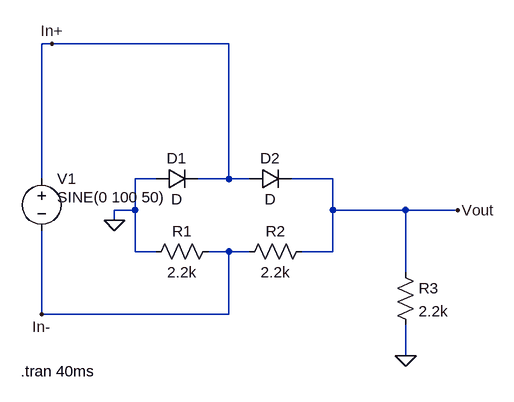
[diagram p0: schematic Assignment 3-2.asc]
Assignment 3-2.asc, the LTspice schematic file:
Version 4.1
SHEET 1 880 680
WIRE 48 -64 32 -64
WIRE 320 -64 48 -64
WIRE 32 144 32 -64
WIRE 208 144 176 144
WIRE 320 144 320 -64
WIRE 320 144 272 144
WIRE 352 144 320 144
WIRE 480 144 416 144
WIRE 176 192 176 144
WIRE 176 192 144 192
WIRE 480 192 480 144
WIRE 592 192 480 192
WIRE 672 192 592 192
WIRE 144 208 144 192
WIRE 176 256 176 192
WIRE 208 256 176 256
WIRE 320 256 288 256
WIRE 352 256 320 256
WIRE 480 256 480 192
WIRE 480 256 432 256
WIRE 592 288 592 192
WIRE 32 352 32 224
WIRE 320 352 320 256
WIRE 320 352 32 352
WIRE 592 416 592 368
FLAG 144 208 0
FLAG 592 416 0
FLAG 672 192 Vout
FLAG 32 352 In-
FLAG 48 -64 In+
SYMBOL voltage 32 128 R0
WINDOW 3 24 44 Left 2
WINDOW 123 0 0 Left 0
WINDOW 39 0 0 Left 0
SYMATTR InstName V1
SYMATTR Value SINE(0 100 50)
SYMBOL diode 208 160 R270
WINDOW 0 32 32 VTop 2
WINDOW 3 0 32 VBottom 2
SYMATTR InstName D1
SYMBOL diode 352 160 R270
WINDOW 0 32 32 VTop 2
WINDOW 3 0 32 VBottom 2
SYMATTR InstName D2
SYMBOL res 304 240 R90
WINDOW 0 0 56 VBottom 2
WINDOW 3 32 56 VTop 2
SYMATTR InstName R1
SYMATTR Value 2.2k
SYMBOL res 448 240 R90
WINDOW 0 0 56 VBottom 2
WINDOW 3 32 56 VTop 2
SYMATTR InstName R2
SYMATTR Value 2.2k
SYMBOL res 576 272 R0
SYMATTR InstName R3
SYMATTR Value 2.2k
TEXT 0 440 Left 2 !.tran 40ms

The netlist it stands for:
* Assignment 3-2.asc
V1 In+ In- SINE(0 100 50)
D1 0 In+ D
D2 In+ Vout D
R1 In- 0 2.2k
R2 Vout In- 2.2k
R3 Vout 0 2.2k
.model D D
.lib standard.dio
.tran 40ms
.backanno
.end